# EAGLE design pro-mini-enclosure-rev-a (EAGLE 7.3.0)
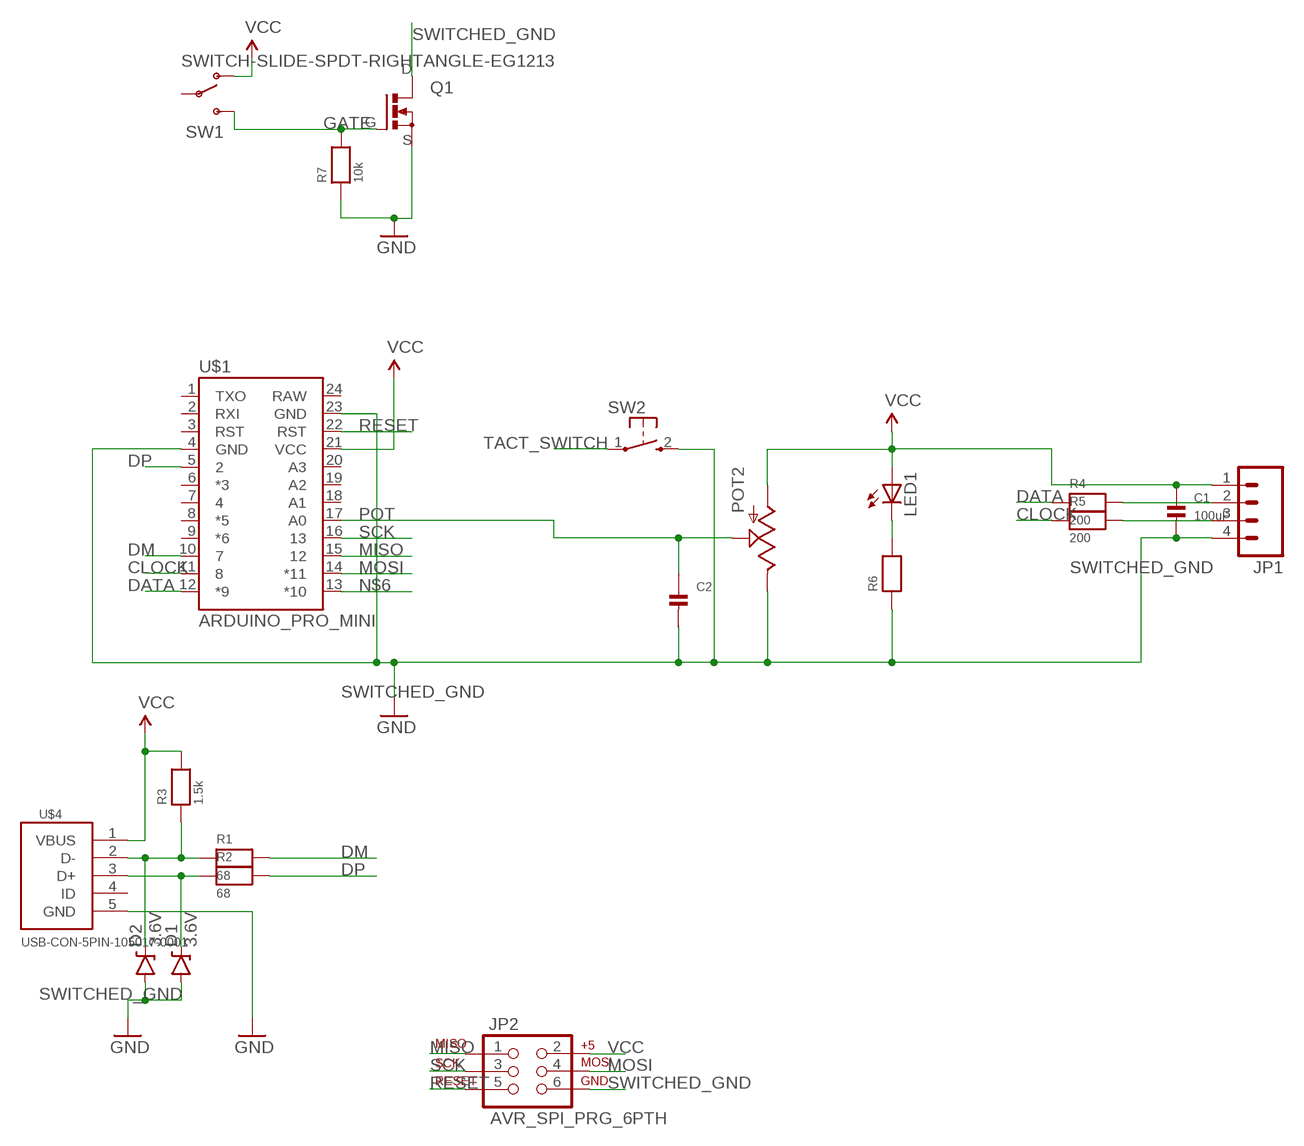
[diagram p0: schematic, sheet 1]

## Parts
C1  100uF  CAP_CERAMIC1206  [1206]
C2  CAP_CERAMIC0603MINI  [0603-MINI]
D1  3.6V  DIODE-ZENER3.6V  [SOD-323]
D2  3.6V  DIODE-ZENER3.6V  [SOD-323]
JP1  M04PTH  [1X04]
JP2  AVR_SPI_PRG_6PTH  [2X3]
LED1  LEDCHIPLED_0603  [CHIPLED_0603]
POT2  THUMBWHEEL-POTENTIOMETER  [3352T]
Q1  DMN1019USN  [SC59]
R1  68  RESISTOR0603MINI  [0603-MINI]
R2  68  RESISTOR0603MINI  [0603-MINI]
R3  1.5k  RESISTOR0603MINI  [0603-MINI]
R4  200  RESISTOR0603MINI  [0603-MINI]
R5  200  RESISTOR0603MINI  [0603-MINI]
R6  RESISTOR0603MINI  [0603-MINI]
R7  10k  RESISTOR0603MINI  [0603-MINI]
SW1  SWITCH-SLIDE-SPDT-RIGHTANGLE-EG1213  [SWITCH-SPDT-RIGHTANGLE-EG1213]
SW2  TACTILE-SWITCH-1825027  [1825027]
U$1  ARDUINO_PRO_MINI  [ARDUINO_PRO_MINI]
U$4  USB-CON-5PIN-105017-0001  [USB-MICRO-MOLEX-105017-0001]

## Nets
CLOCK: R5.1 U$1.11
DATA: R4.1 U$1.12(*9)
DM: R1.2 U$1.10
DP: R2.2 U$1.5
GATE: Q1.G R7.2 SW1.3
GND: Q1.S R7.1 U$4.5(GND)
MISO: JP2.1 U$1.15
MOSI: JP2.4 U$1.14(*11)
N$1: D2.C R1.1 R3.1 U$4.2(D-)
N$2: D1.C R2.1 U$4.3(D+)
N$3: LED1.C R6.2
N$4: JP1.2 R4.2
N$5: JP1.3 R5.2
N$6: U$1.13(*10)
POT: C2.1 POT2.2 U$1.17(A0)
RESET: JP2.5 U$1.22(RST)
SCK: JP2.3 U$1.16
SWITCHED_GND: C1.2 C2.2 D1.A D2.A JP1.4 JP2.6 POT2.3 Q1.D R6.1 SW2.2 U$1.4(GND) U$1.23(GND) ; supply symbol labelled GND
TACT_SWITCH: SW2.1
VCC: C1.1 JP1.1 JP2.2 LED1.A POT2.1 R3.2 SW1.1 U$1.21(VCC) U$4.1(VBUS)
Unconnected: SW1.2(COMMON) U$1.1(TXO) U$1.2(RXI) U$1.3(RST) U$1.6(*3) U$1.7 U$1.8(*5) U$1.9(*6) U$1.18(A1) U$1.19(A2) U$1.20(A3) U$1.24(RAW) U$4.4(ID)

## Library data of the parts
C1 C2 = microbuilder:CAP_CERAMIC: Ceramic Capacitors 0402 - 0402 Surface Mount Capacitors 16pF 50V 5% [Digikey: 445-4899-2-ND] 18pF 50V 5% [Digikey: 490-1281-2-ND] 22pF 50V 5% [Digikey: 490-1283-2-ND] 68pF 50V 5% [Digikey: 490-1289-2-ND] 0.1uF 10V 10% [Digikey: 490-1318-2-ND] 1.0uF 6.3V 10% [Digikey: 490-1320-2-ND] 0603 - 0603 Surface Mount Capacitors 16 pF 50V 5% [Digikey: 445-5051-2-ND] 22 pF 50V [Digikey: PCC220ACVTR-ND] 33 pF 50V 5% [Digikey: 490-1415-1-ND] 56pF 50V 5% [Digikey: 490-1421-1-ND] 220pF 50V 5% [Digikey: 445-1285-1-ND] 680 pF 50V 2200 pF 50V 5% C0G [Digikey: 445-1297-1-ND] 5600 pF 100V 5% X7R [Digikey: 478-3711-1-ND] 0.1 µF 25V 10% [Digikey: PCC2277TR-ND] 0.22 µF 16V 10% X7R [Digikey: 445-1318-1-ND] 1.0 µF 25V 10% [Digikey: 445-5146-2-ND] 0603 - RF Specific 3pF 250V +/-0.1pF RF [Digikey: 712-1347-1-ND] 18 pF 250V 5% [Digikey: 478-3505-1-ND or 712-1322-1-ND] 56 pF 250V 5% C0G RF [Digikey: 490-4867-1-ND] 68 pF 250V RF [Digikey: 490-4868-1-ND] 0805 - 0805 Surface Mount Capacitors 220 pF 250V 2% RF Ceramic Capacitor [Digikey: 712-1398-1-ND] 1000 pF 50V 2% NP0 Ceramic Capacitor [Digikey: 478-3760-1-ND] 0.1 µF 25V 10% Ceramic Capacitor [Digikey: PCC1828TR-ND] 1.0 µF 16V 10% Ceramic Capacitor[Digikey: 490-1691-2-ND] 10.0 µF 10V 10% Ceramic Capacitor[Digikey: 709-1228-1-ND] 10.0 uF 16V 10% Ceramic Capacitor [Digikey: 478-5165-2-ND] 47 uF 6.3V 20% Ceramic Capacitor [Digikey: 587-1779-1-ND or 399-5506-1-ND] 1206 - 1206 Surface Mount Capacitors 47uF 10V 20% Ceramic Capacitor [Digikey: 490-5528-1-ND or 399-5508-1-ND or 445-6010-1-ND] 100uF 6.3V -20%, +80% Y5V Ceramic Capacitor (Digikey: 490-4512-1-ND, Mouser: 81-GRM31CF50J107ZE1L)
D1 D2 = SparkFun-DiscreteSemi:DIODE-ZENER: Zener Diode Production Part - 8199 3.4V Zener Voltage
JP1 = SparkFun-Connectors:M04: Header 4 Standard 4-pin 0.1" header. Use with straight break away headers (SKU : PRT-00116), right angle break away headers (PRT-00553), swiss pins (PRT-00743), machine pins (PRT-00117), and female headers (PRT-00115). Molex polarized connector foot print use with SKU : PRT-08231 with associated crimp pins and housings. 1MM SMD Version SKU: PRT-10208
JP2 = SparkFun-Connectors:AVR_SPI_PRG_6: AVR ISP 6 Pin This is the reduced ISP connector for AVR programming. Common on Arduino. This footprint will take up less PCB space and can be used with a 10-pin to 6-pin adapter such as SKU: BOB-08508 **Special note about "TEST_POINT" package. The stop mask is on the top side, so if you want your programming test points to be on the bottom of your board, make sure to place this package on the bottom side of the board. This also ensure that the orientation to program from the bottom side will be correct.
LED1 = adafruit:LED: LED OSRAM: - CHIPLED LG R971, LG N971, LY N971, LG Q971, LY Q971, LO R971, LY R971 LH N974, LH R974 LS Q976, LO Q976, LY Q976 LO Q996 - Hyper CHIPLED LW Q18S LB Q993, LB Q99A, LB R99A - SideLED LS A670, LO A670, LY A670, LG A670, LP A670 LB A673, LV A673, LT A673, LW A673 LH A674 LY A675 LS A676, LA A676, LO A676, LY A676, LW A676 LS A679, LY A679, LG A679 - Hyper Micro SIDELED® LS Y876, LA Y876, LO Y876, LY Y876 LT Y87S - SmartLED LW L88C, LW L88S LB L89C, LB L89S, LG L890 LS L89K, LO L89K, LY L89K LS L896, LA L896, LO L896, LY L896 - TOPLED LS T670, LO T670, LY T670, LG T670, LP T670 LSG T670, LSP T670, LSY T670, LOP T670, LYG T670 LG T671, LOG T671, LSG T671 LB T673, LV T673, LT T673, LW T673 LH T674 LS T676, LA T676, LO T676, LY T676, LB T676, LH T676, LSB T676, LW T676 LB T67C, LV T67C, LT T67C, LS T67K, LO T67K, LY T67K, LW E67C LS E67B, LA E67B, LO E67B, LY E67B, LB E67C, LV E67C, LT E67C LW T67C LS T679, LY T679, LG T679 LS T770, LO T770, LY T770, LG T770, LP T770 LB T773, LV T773, LT T773, LW T773 LH T774 LS E675, LA E675, LY E675, LS T675 LS T776, LA T776, LO T776, LY T776, LB T776 LHGB T686 LT T68C, LB T68C - Hyper Mini TOPLED® LB M676 - Mini TOPLED Santana® LG M470 LS M47K, LO M47K, LY M47K Source: http://www.osram.convergy.de/
POT2 = Custom:THUMBWHEEL-POTENTIOMETER
Q1 = Custom:DMN1019USN
R1-R7 = microbuilder:RESISTOR: Resistors 0402 - 0402 Surface Mount Package 22 Ohm 1% 1/16W [Digikey: 311-22.0LRTR-ND] 33 Ohm 5% 1/16W 1.0K 5% 1/16W 1.5K 5% 1/16W 2.0K 1% 1/16W 10.0K 1% 1/16W [Digikey: 311-10.0KLRTR-ND] 10.0K 5% 1/16W [Digikey: RMCF0402JT10K0TR-ND] 12.1K 1% 1/16W [Digikey: 311-22.0LRTR-ND] 100.0K 5% 1/16W 0603 - 0603 Surface Mount Package 0 Ohm 1/10 Watt 1% Resistor 15 Ohm 1/10 Watt 1% Resistor 33 Ohm 1/10 Watt 1% Resistor 49.9 Ohm 1/10 Watt 1% Resistor 100 Ohm 1/10 Watt 1% Resistor 150 Ohm 1/10 Watt 1% Resistor 240 Ohm 1/10 Watt 1% Resistor 390 Ohm 1/10 Watt 1% Resistor 560 Ohm 1/10 Watt 1% Resistor 680 Ohm 1/10 Watt 1% Resistor 750 Ohm 1/10 Watt 1% Resistor 1.0K Ohm 1/10 Watt 1% Resistor 1.5K Ohm 1/10 Watt 1% Resistor 2.0K Ohm 1/10 Watt 1% Resistor 2.2K Ohm 1/10 Watt 1% Resistor 3.3K Ohm 1/10 Watt 1% Resistor 4.7K Ohm 1/10 Watt 1% Resistor 10.0K Ohm 1/10 Watt 1% Resistor 12.0K Ohm 1/10 Watt 1% Resistor 12.1K Ohm 1/10 Watt 1% Resistor 20.0K Ohm 1/10 Watt 1% Resistor 33.0K Ohm 1/10 Watt 1% Resistor 100.0K Ohm 1/10 Watt 1% Resistor 0805 - 0805 Surface Mount Package 0 Ohm 1/8 Watt 1% Resistor 33 Ohm 1/8 Watt 1% Resistor 100 Ohm 1/8 Watt 1% Resistor 150 Ohm 1/8 Watt 1% Resistor 200 Ohm 1/8 Watt 1% Resistor 240 Ohm 1/8 Watt 1% Resistor 330 Ohm 1/8 Watt 1% Resistor 390 Ohm 1/8 Watt 1% Resistor 470 Ohm 1/8 Watt 1% Resistor 1.0K Ohm 1/8 Watt 1% Resistor 1.5K Ohm 1/8 Watt 1% Resistor 2.0K Ohm 1/8 Watt 1% Resistor 4.7K Ohm 1/8 Watt 1% Resistor 5.1K Ohm 1/8 Watt 1% Resistor 5.6K Ohm 1/8 Watt 1% Resistor 10.0K Ohm 1/8 Watt 1% Resistor 22.0K Ohm 1/8 Watt 1% Resistor 33.0K Ohm 1/8 Watt 1% Resistor 100K Ohm 1/8 Watt 1% Resistor 1206 - 1206 Surface Mount Package 2012 - 2010 Surface Mount Package 0.11 Ohm 1/2 Watt 1% Resistor - Digikey: RHM.11UCT-ND
SW1 = Custom:SWITCH-SLIDE-SPDT-RIGHTANGLE-EG1213
SW2 = Custom:TACTILE-SWITCH-1825027
U$1 = SparkFun-Boards:ARDUINO_PRO_MINI
U$4 = GeekAmmo:USB-CON-5PIN: Molex Micro USB 105017-0001

## Board
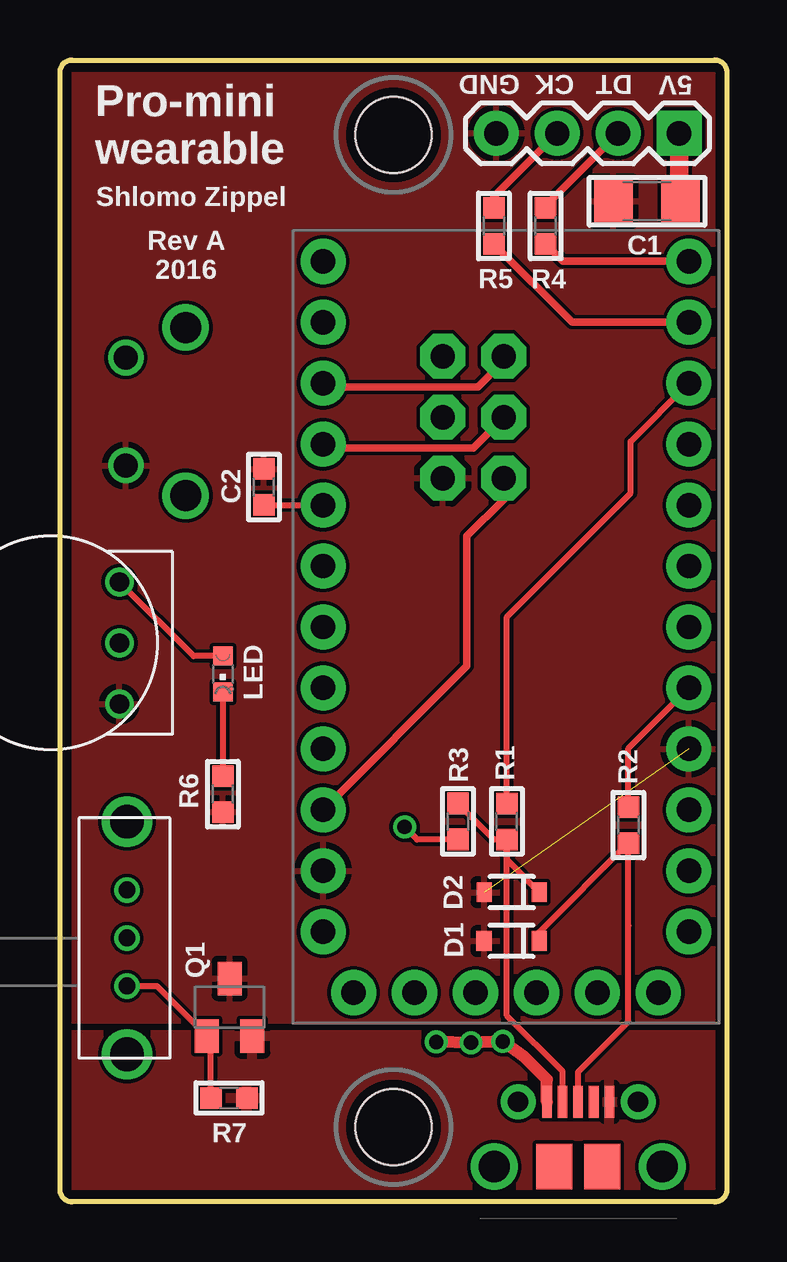
[diagram p1: board, top side]
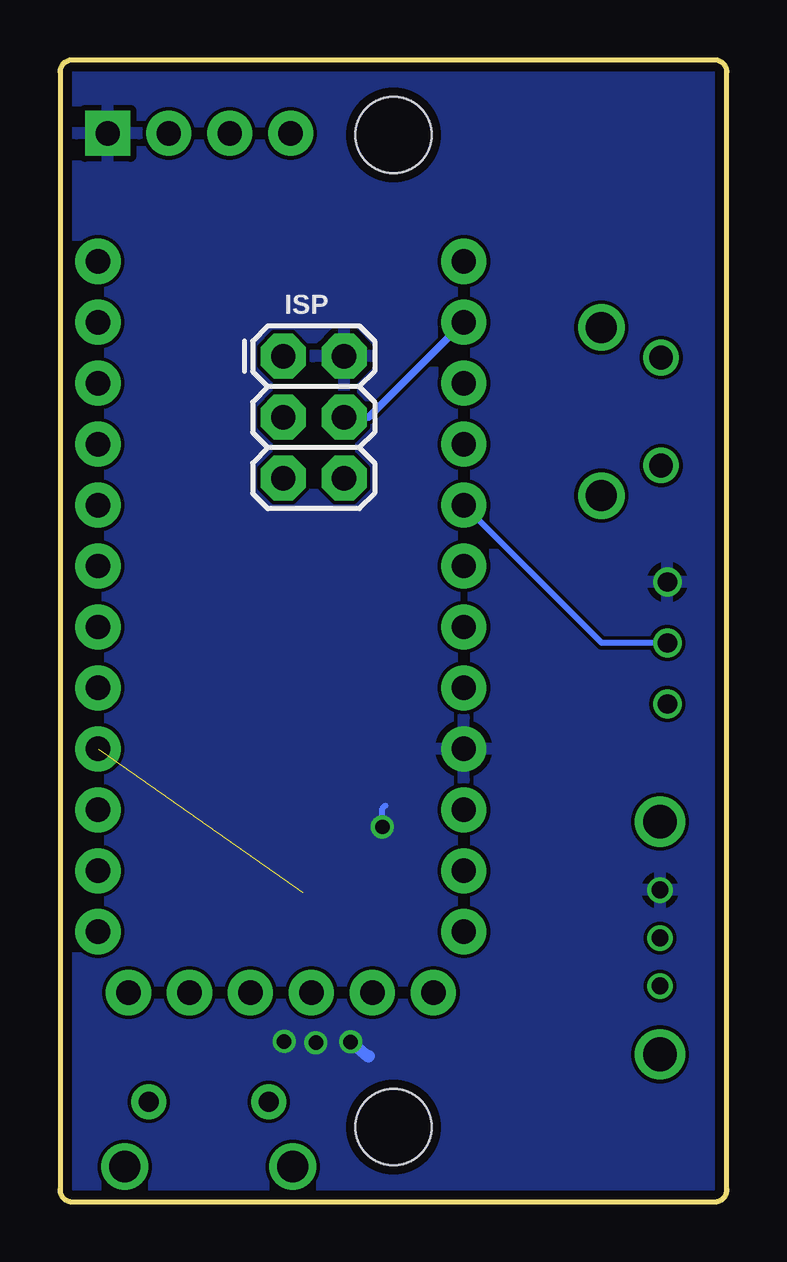
[diagram p2: board, bottom side, seen from below]

Size 27.79 x 47.6 mm. Coordinates in mm from the lower left corner, seen from the top.
Copper layers (1*16): Top 0.0356mm / dielectric 1.5011mm / Bottom 0.0356mm
Design rules "PCBs_io": minimum track width 6mil, minimum drill 13mil, track to track 6mil, track to pad 6mil, pad to pad 6mil, via to via 6mil, smd to smd 6mil, copper to edge 15mil, drill to drill 6mil, minimum pad ring 7mil, minimum via ring 7mil, stop-mask expansion 3mil, vias tented up to drill 0mil, thermal gap 10mil

### Footprints (pad centres in the part's own frame; a part is rotated, then mirrored left to right if it is on the bottom)
1206 = smd 1.6 x 1.8: 1 -1.4,0; 2 1.4,0
0603-MINI = smd 0.9 x 0.9: 1 -0.75,0; 2 0.75,0
SOD-323 = smd 0.63 x 0.83: A 1.15,0; C -1.15,0
1X04 = drill 1.016 pad 1.88 square: 1 0,0 | drill 1.016 pad 1.88: 2 2.54,0; 3 5.08,0; 4 7.62,0
2X3 = drill 1.016 pad 1.88 octagon: 1 0,0; 2 0,2.54; 3 2.54,0; 4 2.54,2.54; 5 5.08,0; 6 5.08,2.54
CHIPLED_0603 = smd 0.8 x 0.8: A 0,-0.75; C 0,0.75
3352T = drill 0.8: 1 2.54,2.21; 2 0,2.21; 3 -2.54,2.21
SC59 = smd 1 x 1.4: D 0,1.2; G -0.95,-1.2; S 0.95,-1.2
SWITCH-SPDT-RIGHTANGLE-EG1213 = drill 0.7: 1 -2,2; 2 0,2; 3 2,2 | drill 1.4: 4 4.85,2; 5 -4.85,2
1825027 = drill 0.991: 1 -2.248,-2.489; 2 2.248,-2.489 | drill 1.295: FRAME1 -3.505,0; FRAME2 3.505,0
ARDUINO_PRO_MINI = drill 1.016 pad 1.88: 1 -7.62,12.7; 2 -7.62,10.16; 3 -7.62,7.62; 4 -7.62,5.08; 5 -7.62,2.54; 6 -7.62,0; 7 -7.62,-2.54; 8 -7.62,-5.08; 9 -7.62,-7.62; 10 -7.62,-10.16; 11 -7.62,-12.7; 12 -7.62,-15.24; 13 7.62,-15.24; 14 7.62,-12.7; 15 7.62,-10.16; 16 7.62,-7.62; 17 7.62,-5.08; 18 7.62,-2.54; 19 7.62,0; 20 7.62,2.54; 21 7.62,5.08; 22 7.62,7.62; 23 7.62,10.16; 24 7.62,12.7; BLK -6.35,15.24; GND -3.81,15.24; GRN 6.35,15.24; RXI 1.27,15.24; TXO 3.81,15.24; VCC -1.27,15.24
USB-MICRO-MOLEX-105017-0001 = smd 0.4 x 1.35: 1 1.2,0; 2 1.85,0; 3 2.5,0; 4 3.15,0; 5 3.8,0 | drill 0.85 pad 1.45: P$1 0,0; P$2 5,0 | smd 1.5 x 1.9: P$3 3.5,-2.7; P$4 1.5,-2.7 | drill 1.3: P$7 -1,-2.7; P$8 6,-2.7
FB-30 = hole 3.175: 3.124,13.894; 44.475,13.894

### Placement (x,y rotation side)
C1  24.46,41.71 180 top
C2  8.5,29.8 90 top
D1  18.82,10.88 180 top
D2  18.82,12.91 180 top
JP1  25.8,44.54 180 top
JP2  18.49,35.25 270 bottom
LED1  6.79,22 180 top
POT2  4.69,23.3 90 top
Q1  7.07,8.11 0 top
R1  18.62,15.86 90 top
R2  23.69,15.71 90 top
R3  16.58,15.86 270 top
R4  20.23,40.68 90 top
R5  18.08,40.68 90 top
R6  6.79,17 90 top
R7  7.04,4.33 180 top
SW1  0.79,11 270 top
SW2  5.23,32.95 270 top
U$1  18.58,23.96 180 top
U$4  19.09,4.17 0 top
U$6  [FB-30]  27.79,0 90 top

### Tracks (layer width: path | path; a pad name or v marks a point on that pad's centre or on a via)
CLOCK
  Top 0.305: U$1.11 21.35,36.67 R5.1
DATA
  Top 0.305: U$1.12 20.96,39.21 R4.1
DM
  Top 0.254: R1.2 18.62,24.39 23.78,29.55 23.78,31.7 U$1.10
DP
  Top 0.254: R2.2 23.69,18.91 U$1.5
GATE
  Top 0.254: R7.2 6.29,6.74 Q1.G 4.03,9 SW1.3
GND
  pour Top: -0.22,6.97 27.84,6.97 27.84,-0.4 -0.22,-0.4
MISO
  Top 0.305: U$1.15 11.12,33.97 17.41,33.97 18.49,35.05 JP2.1
MOSI
  Bottom 0.305: U$1.14 14.92,32.71 JP2.4
N$1
  Top 0.254: U$4.2 20.94,5.44 18.62,7.76 R1.1 | R1.1 18.62,14.27 D2.C | R1.1 18.08,15.11 R3.1
N$2
  Top 0.254: U$4.3 21.59,5.41 23.68,7.5 23.68,11.52 R2.1 19.97,11.24 D1.C
N$3
  Top 0.254: LED1.C R6.2
N$4
  Top 0.305: R4.2 20.28,41.57 JP1.2
N$5
  Top 0.305: R5.2 18.08,41.91 JP1.3
POT
  Top 0.254: C2.1 U$1.17
  Bottom 0.254: POT2.2 5.22,23.3 U$1.17
RESET
  Top 0.305: U$1.22 16.95,22.33 16.95,27.75 18.49,29.29 JP2.5
SCK
  Top 0.305: U$1.16 11.12,31.43 17.23,31.43 18.49,32.69 JP2.3
SWITCHED_GND  (1 unrouted)
  pour Top: -0.02,47.71 27.92,47.71 27.92,7.55 0.01,7.55 0.01,47.64
VCC  (via drill 0.6)
  Top 0.254: LED1.A 5.57,22.75 POT2.1 | R3.2 14.88,15.11 v14.36,15.63
  Top 0.508: U$4.1 20.29,5.1 19.34,6.06 v18.45,6.69 v17.13,6.64 v15.68,6.67
  Top 0.762: C1.1 25.8,41.77 JP1.1
  Bottom 0.254: v14.36,15.63 14.36,16.39 14.23,16.52
  Bottom 0.508: v15.68,6.67 14.94,6.06 14.92,6.08
  pour Bottom: -0.02,47.56 28.02,47.56 28.02,-0.73 0.01,-0.73 0.01,47.43

### Text on the board
tPlace: GND | CK | DT | 5V | Pro-mini / wearable | Shlomo Zippel | Rev A / 2016 | LED
bPlace: ISP